# Altium schematic sheet 心电背心.SchDoc
size A2
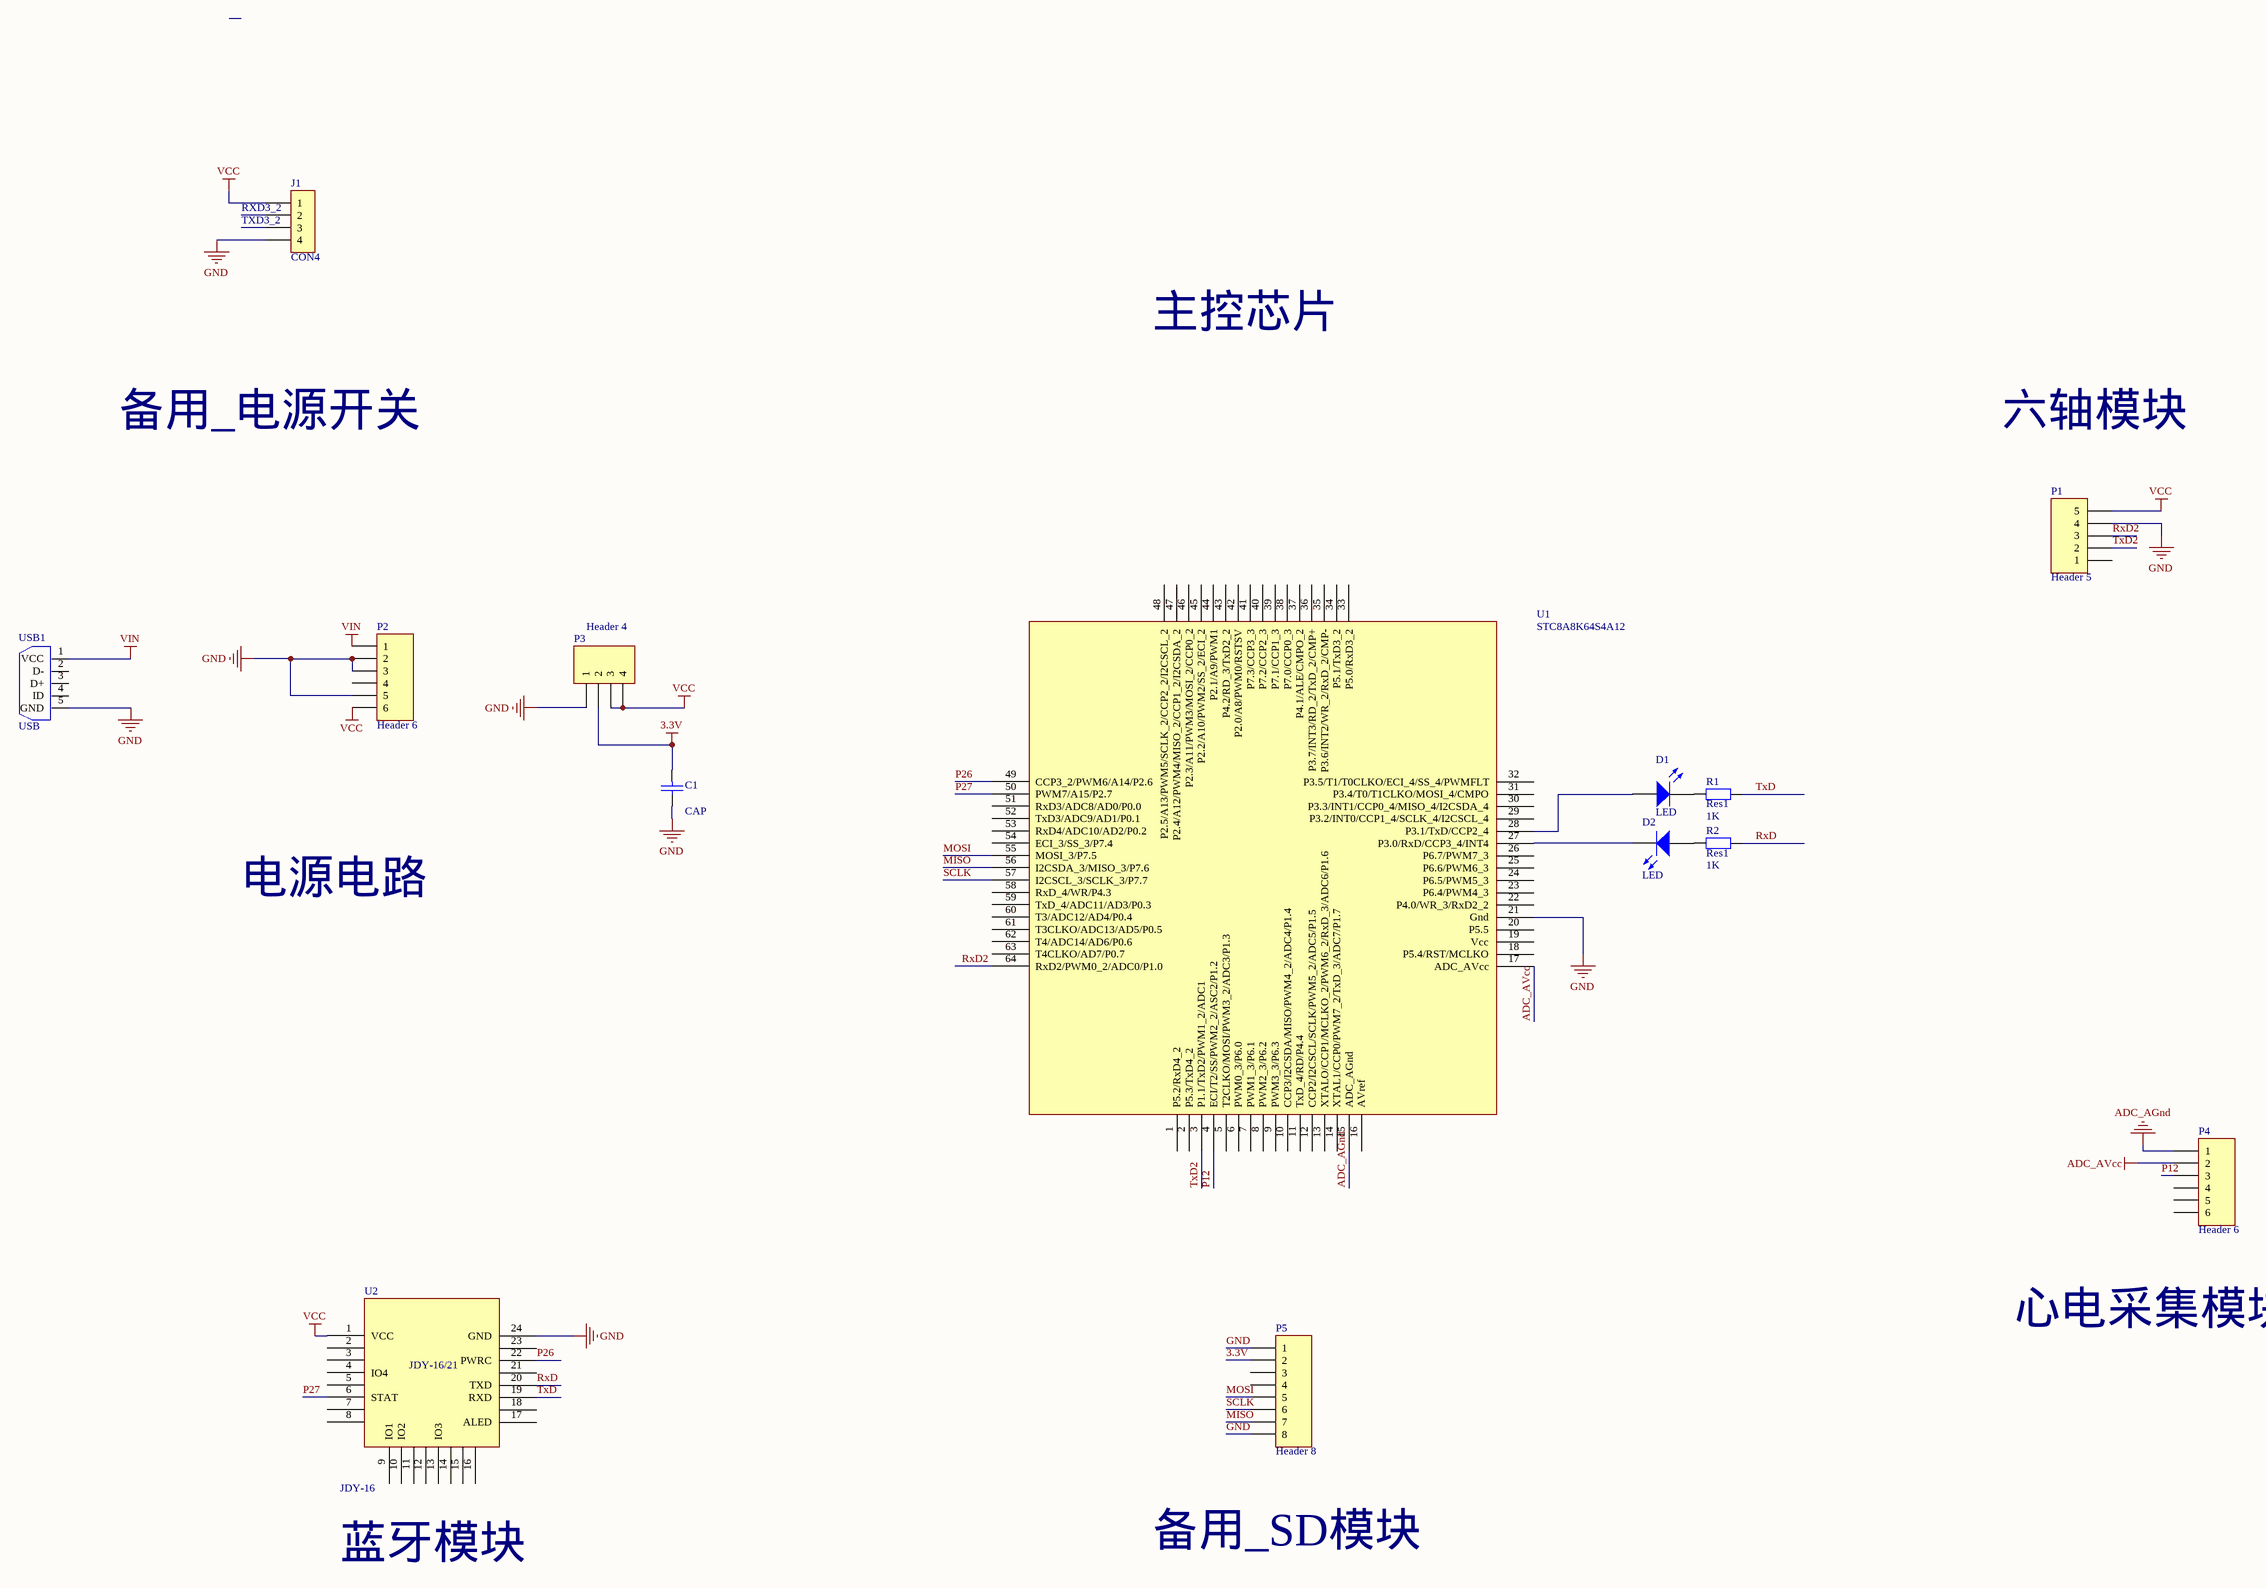
[diagram p0: 心电背心.SchDoc]

## Parts
C1  CAP  [0805_L]
D1  LED  [LED-0]
D2  LED  [LED-0]
J1  CON4  [SP4-1]
P1  Header 5  [HDR1X5]
P2  Header 6  [HT396K-6]
P3  Header 4  [1117]
P4  Header 6  [HT396K-6]
P5  Header 8  [HDR1X8]
R1  Res1  value 1K  [AXIAL-0.4]
R2  Res1  value 1K  [AXIAL-0.4]
U1  STC8A8K64S4A12  [LQFP-64_10x10x05P_Q2]
U2  JDY-16  [JDY16]
USB1  USB  [MICRO_USB5P_SOP]

## Nets
3.3V: C1.1 P3.2 P5.2
ADC_AGnd: P4.1 U1.15(ADC_AGnd)
ADC_AVcc: P4.2 U1.17(ADC_AVcc)
GND: C1.2 J1.4 P1.4 P2.2 P2.3 P2.5 P3.1 P5.1 P5.8 U1.21(Gnd) U2.24(GND) USB1.5(GND)
VCC: J1.1 P1.5 P2.6 P3.3 P3.4 U2.1(VCC)
VIN: P2.1 USB1.1(VCC)
MISO: P5.7 U1.56(I2CSDA_3/MISO_3/P7.6)
MOSI: P5.5 U1.55(MOSI_3/P7.5)
P12: P4.3 U1.4(ECI/T2/SS/PWM2_2/ASC2/P1.2)
P26: U1.49(CCP3_2/PWM6/A14/P2.6) U2.22(PWRC)
P27: U1.50(PWM7/A15/P2.7) U2.6(STAT)
RxD: R2.2 U2.20(TXD)
RxD2: P1.3 U1.64(RxD2/PWM0_2/ADC0/P1.0)
SCLK: P5.6 U1.57(I2CSCL_3/SCLK_3/P7.7)
TxD: R1.2 U2.19(RXD)
TxD2: P1.2 U1.3(P1.1/TxD2/PWM1_2/ADC1)
NetD1_1: D1.1(A) U1.28(P3.1/TxD/CCP2_4)
NetD1_2: D1.2(K) R1.1
NetD2_1: D2.1(A) R2.1
NetD2_2: D2.2(K) U1.27(P3.0/RxD/CCP3_4/INT4)

Not connected (* = marked no-connect by the designer): J1 2 3; P1 1; P2 4; P4 4 5 6; P5 3 4; U1 1(P5.2/RxD4_2) 2(P5.3/TxD4_2) 5(T2CLKO/MOSI/PWM3_2/ADC3/P1.3) 6(PWM0_3/P6.0) 7(PWM1_3/P6.1) 8(PWM2_3/P6.2) 9(PWM3_3/P6.3) 10(CCP3/I2CSDA/MISO/PWM4_2/ADC4/P1.4) 11(TxD_4/RD/P4.4) 12(CCP2/I2CSCL/SCLK/PWM5_2/ADC5/P1.5) 13(XTALO/CCP1/MCLKO_2/PWM6_2/RxD_3/ADC6/P1.6) 14(XTAL1/CCP0/PWM7_2/TxD_3/ADC7/P1.7) 16(AVref) 18(P5.4/RST/MCLKO) 19(Vcc) 20(P5.5) 22(P4.0/WR_3/RxD2_2) 23(P6.4/PWM4_3) 24(P6.5/PWM5_3) 25(P6.6/PWM6_3) 26(P6.7/PWM7_3) 29(P3.2/INT0/CCP1_4/SCLK_4/I2CSCL_4) 30(P3.3/INT1/CCP0_4/MISO_4/I2CSDA_4) 31(P3.4/T0/T1CLKO/MOSI_4/CMPO) 32(P3.5/T1/T0CLKO/ECI_4/SS_4/PWMFLT) 33(P5.0/RxD3_2) 34(P5.1/TxD3_2) 35(P3.6/INT2/WR_2/RxD_2/CMP-) 36(P3.7/INT3/RD_2/TxD_2/CMP+) 37(P4.1/ALE/CMPO_2) 38(P7.0/CCP0_3) 39(P7.1/CCP1_3) 40(P7.2/CCP2_3) 41(P7.3/CCP3_3) 42(P2.0/A8/PWM0/RSTSV) 43(P4.2/RD_3/TxD2_2) 44(P2.1/A9/PWM1) 45(P2.2/A10/PWM2/SS_2/ECI_2) 46(P2.3/A11/PWM3/MOSI_2/CCP0_2) 47(P2.4/A12/PWM4/MISO_2/CCP1_2/I2CSDA_2) 48(P2.5/A13/PWM5/SCLK_2/CCP2_2/I2CSCL_2) 51(RxD3/ADC8/AD0/P0.0) 52(TxD3/ADC9/AD1/P0.1) 53(RxD4/ADC10/AD2/P0.2) 54(ECI_3/SS_3/P7.4) 58(RxD_4/WR/P4.3) 59(TxD_4/ADC11/AD3/P0.3) 60(T3/ADC12/AD4/P0.4) 61(T3CLKO/ADC13/AD5/P0.5) 62(T4/ADC14/AD6/P0.6) 63(T4CLKO/AD7/P0.7); U2 2 3 4(IO4) 5 7 8 9(IO1) 10(IO2) 11 12 13(IO3) 14 15 16 17(ALED) 18 21 23; USB1 2(D-) 3(D+) 4(ID)

## Notes on the sheet
- (near J1) RXD3_2
- (near J1) TXD3_2
- 主控芯片
- 备用_电源开关
- 六轴模块
- 电源电路
- 心电采集模块
- 蓝牙模块
- 备用_SD模块
- (in symbol JDY21) JDY-16/21

## Library data of the parts
C1 = CAP: Capacitor
D1 D2 = LED0: Typical INFRARED GaAs LED; Published: 8-Jun-2000; LatestRevisionDate: 08-Jul-2005; LatestRevisionNote: Mech Layer 1 removed.; PackageReference: LED-0; Publisher: Altium Limited; PackageDescription: LED; 2 Leads
J1 = CON4: Connector
P1 = Header 5: Header, 5-Pin; LatestRevisionDate: 17-Jul-2002; LatestRevisionNote: Re-released for DXP Platform.; Publisher: Altium Limited
P2 P4 = Header 6: Header, 6-Pin; LatestRevisionDate: 17-Jul-2002; LatestRevisionNote: Re-released for DXP Platform.; Publisher: Altium Limited
P3 = Header 4: Header, 4-Pin; LatestRevisionDate: 17-Jul-2002; LatestRevisionNote: Re-released for DXP Platform.; Publisher: Altium Limited
P5 = Header 8: Header, 8-Pin; LatestRevisionDate: 17-Jul-2002; LatestRevisionNote: Re-released for DXP Platform.; Publisher: Altium Limited
R1 R2 = Res2: Resistor; Published: 8-Jun-2000; LatestRevisionDate: 17-Jul-2002; LatestRevisionNote: Re-released for DXP Platform.; PackageReference: AXIAL-0.4; Publisher: Altium Limited; PackageDescription: Axial Device, Thru-Hole; 2 Leads; 0.4 in Pin Spacing
U1 = STC8A8K64S4A12: LQFP64
U2 = JDY21
USB1 = USB5